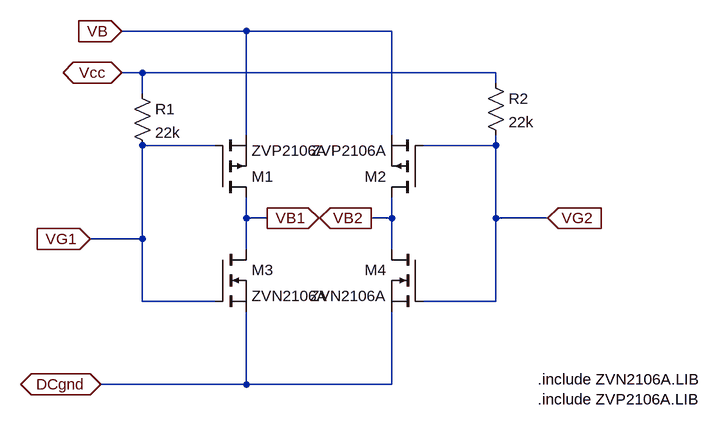
[diagram p0: schematic Motor_Direction.asc]
Motor_Direction.asc, the LTspice schematic file:
Version 4
SHEET 1 880 680
WIRE 128 0 -64 0
WIRE 352 0 128 0
WIRE -32 64 -64 64
WIRE 512 64 -32 64
WIRE 512 80 512 64
WIRE -32 96 -32 64
WIRE 128 160 128 0
WIRE 352 160 352 0
WIRE 80 176 -32 176
WIRE 512 176 512 160
WIRE 512 176 400 176
WIRE 128 288 128 256
WIRE 160 288 128 288
WIRE 352 288 352 256
WIRE 352 288 320 288
WIRE 512 288 512 176
WIRE 592 288 512 288
WIRE -32 320 -32 176
WIRE -32 320 -112 320
WIRE 128 336 128 288
WIRE 352 336 352 288
WIRE -32 416 -32 320
WIRE 80 416 -32 416
WIRE 512 416 512 288
WIRE 512 416 400 416
WIRE 128 544 128 432
WIRE 128 544 -96 544
WIRE 352 544 352 432
WIRE 352 544 128 544
FLAG -64 0 VB
IOPIN -64 0 In
FLAG -64 64 Vcc
IOPIN -64 64 BiDir
FLAG -112 320 VG1
IOPIN -112 320 In
FLAG -96 544 DCgnd
IOPIN -96 544 BiDir
FLAG 160 288 VB1
IOPIN 160 288 Out
FLAG 320 288 VB2
IOPIN 320 288 Out
FLAG 592 288 VG2
IOPIN 592 288 In
SYMBOL pmos 80 256 M180
SYMATTR InstName M1
SYMATTR Value ZVP2106A
SYMBOL pmos 400 256 R180
SYMATTR InstName M2
SYMATTR Value ZVP2106A
SYMBOL nmos 80 336 R0
SYMATTR InstName M3
SYMATTR Value ZVN2106A
SYMBOL nmos 400 336 M0
SYMATTR InstName M4
SYMATTR Value ZVN2106A
SYMBOL res -48 80 R0
SYMATTR InstName R1
SYMATTR Value 22k
SYMBOL res 496 64 R0
SYMATTR InstName R2
SYMATTR Value 22k
TEXT 576 536 Left 2 !.include ZVN2106A.LIB\n.include ZVP2106A.LIB

The netlist it stands for:
* Motor_Direction.asc
M1 VB1 VG1 VB VB ZVP2106A
M2 VB2 VG2 VB VB ZVP2106A
M3 VB1 VG1 DCgnd DCgnd ZVN2106A
M4 VB2 VG2 DCgnd DCgnd ZVN2106A
R1 Vcc VG1 22k
R2 Vcc VG2 22k
.model NMOS NMOS
.model PMOS PMOS
.lib standard.mos
.include ZVN2106A.LIB
.include ZVP2106A.LIB
.backanno
.end